# EAGLE design ScanseSweep Final (EAGLE 9.5.1)
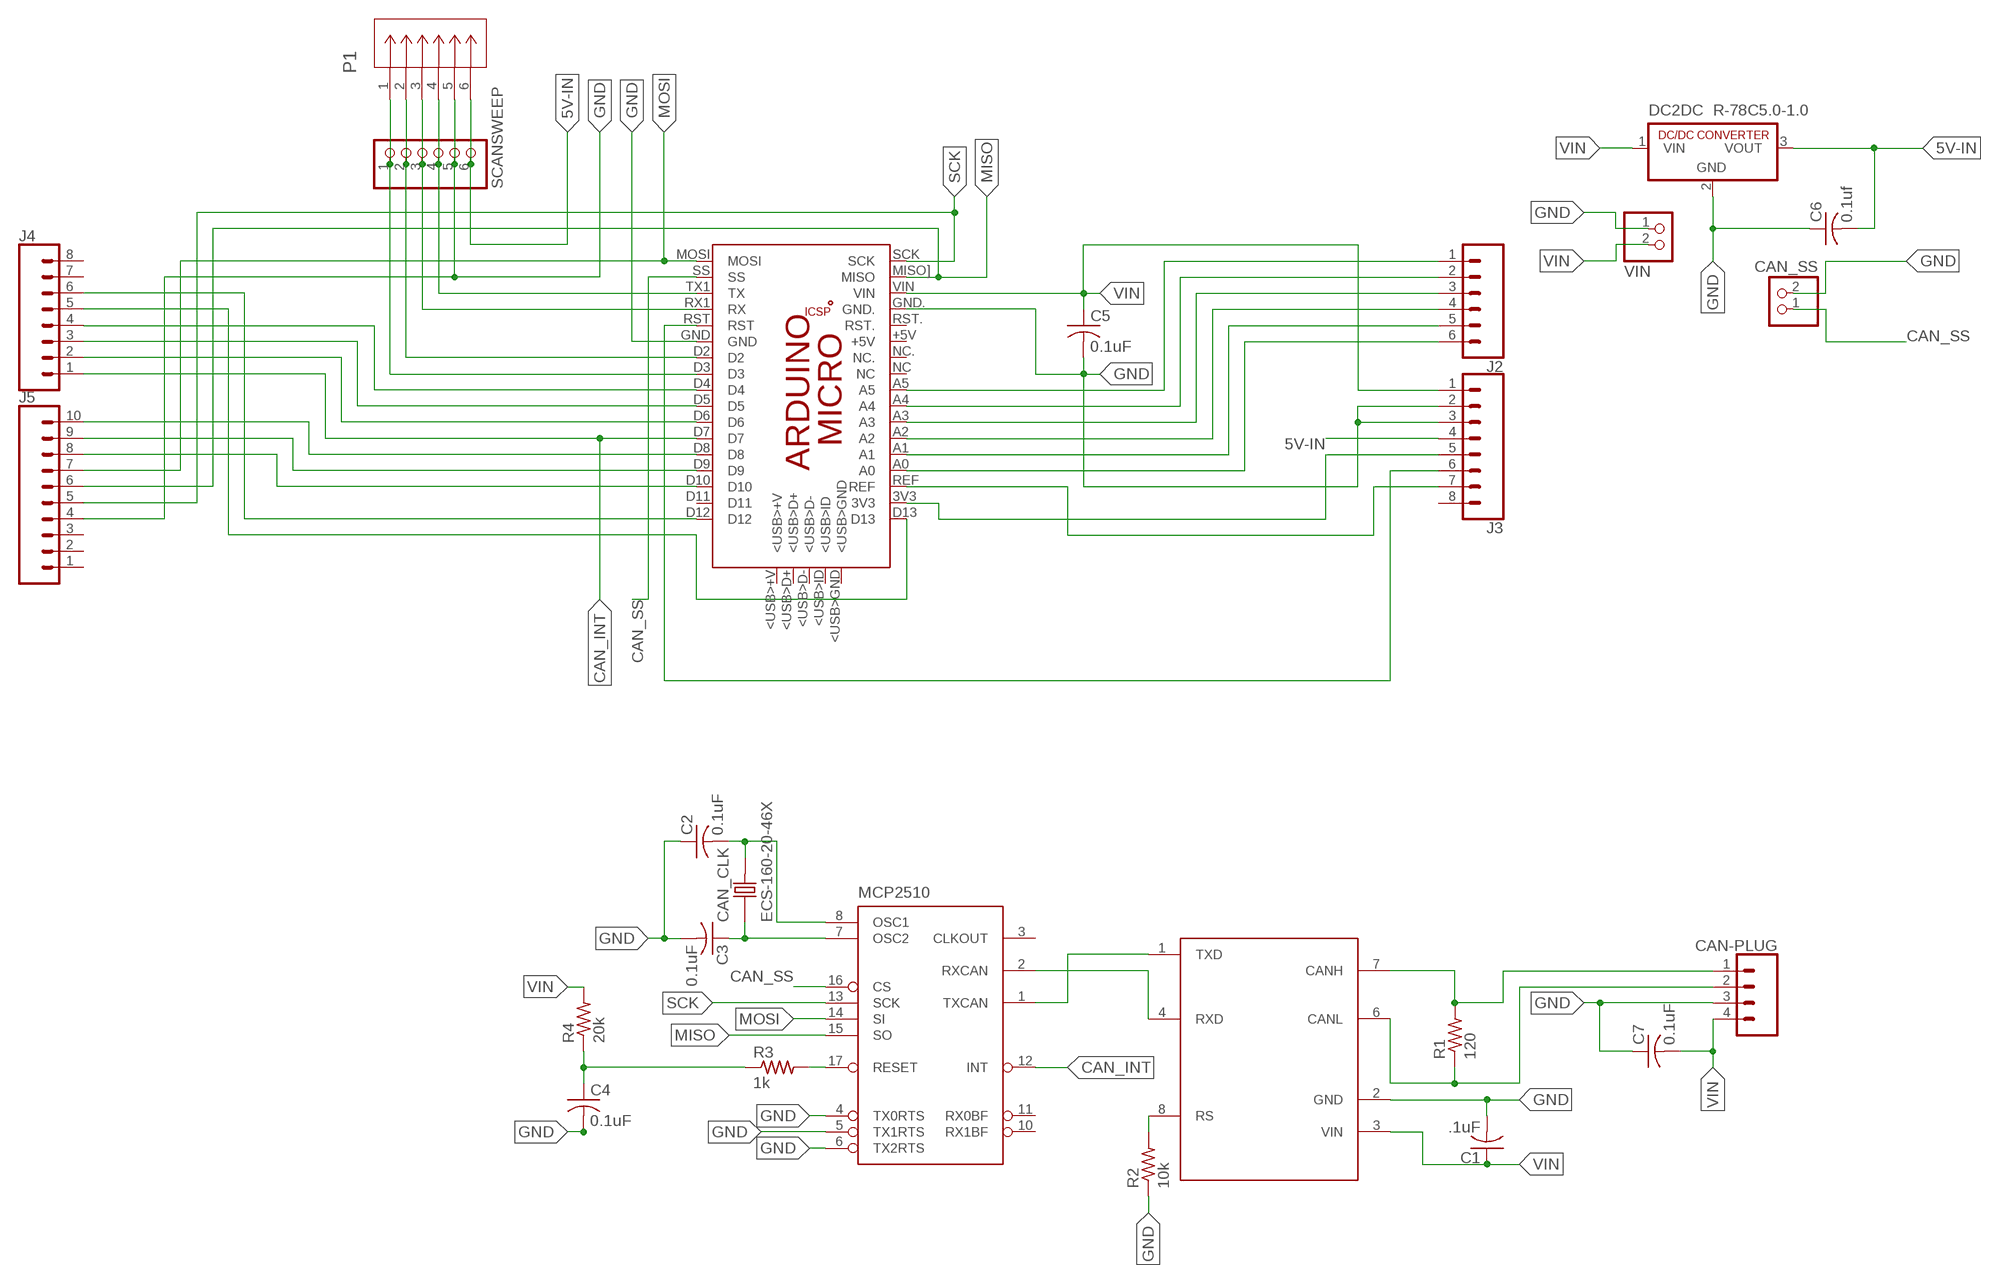
[diagram p0: schematic, sheet 1]

## Parts
C1  .1uF  C-US025-024X044  [C025-024X044]
C2  0.1uF  C-US025-024X044  [C025-024X044]
C3  0.1uF  C-US025-024X044  [C025-024X044]
C4  0.1uF  C-US025-024X044  [C025-024X044]
C5  0.1uF  C-US025-024X044  [C025-024X044]
C6  0.1uf  C-US025-024X044  [C025-024X044]
C7  0.1uF  C-US025-024X044  [C025-024X044]
CAN_CLK  ECS-160-20-46X  [XTAL_ECS-160-20-46X]
CAN_SS_TEST  CAN_SS  PINHD-1X2  [1X02]
DC2DC  R-78C5.0-1.0  [SIP3]
J1  CAN-PLUG  CONN_04SCREW  [SCREWTERMINAL-3.5MM-4]
J2  CONN_06SILK_FEMALE_PTH  [1X06]
J3  CONN_08"  [1X08]
J4  CONN_08"  [1X08]
J5  CONN_10"  [1X10]
MCP2510  MCP2510P  [DIL18]
MCP2551  MCP2551MCP2551  [DIL08]
P1  S6B-ZR(LF)(SN)  [S6B-ZR]
PCB2  ARDUINO_MICRO  [ARDUINO_MICRO]
R1  120  R-US_0204/5  [0204/5]
R2  10k  R-US_0204/5  [0204/5]
R3  1k  R-US_0204/5  [0204/5]
R4  20k  R-US_0204/5  [0204/5]
SCANSESWEEP  SCANSWEEP  PINHD-1X6  [1X06]
VIN_TEST  VIN  PINHD-1X2  [1X02]

## Nets
3.3V: J3.5 PCB2.3V3
5V-IN: C6.2 DC2DC.3(VOUT) J3.4 P1.6 SCANSESWEEP.6
A0: J2.6 PCB2.A0
A1: J2.5 PCB2.A1
A2: J2.4 PCB2.A2
A3: J2.3 PCB2.A3
A4: J2.2 PCB2.A4
A5: J2.1 PCB2.A5
CAN_INT: J4.1 MCP2510.12(INT) PCB2.D7
CAN_SS [New Class]: CAN_SS_TEST.1 MCP2510.16(CS) PCB2.SS
CANH: J1.1 MCP2551.7(CANH) R1.2
CANL: J1.2 MCP2551.6(CANL) R1.1
D2: P1.2 PCB2.D2 SCANSESWEEP.2
D3: P1.1 PCB2.D3 SCANSESWEEP.1
D4: J4.4 PCB2.D4
D5: J4.3 PCB2.D5
D6: J4.2 PCB2.D6
D8: J5.10 PCB2.D8
D9: J5.9 PCB2.D9
D10 [New Class]: J5.8 PCB2.D10
D12: J4.6 PCB2.D12
D13: J4.5 PCB2.D13
GND: C1.2 C2.1 C3.2 C4.2 C5.2 C6.1 C7.1 CAN_SS_TEST.2 DC2DC.2(GND) J1.3 J3.2 J3.3 J5.4 MCP2510.4(TX0RTS) MCP2510.5(TX1RTS) MCP2510.6(TX2RTS) MCP2551.2(GND) P1.5 PCB2.GND PCB2.GND. R2.1 SCANSESWEEP.5 VIN_TEST.1
MISO: J5.6 MCP2510.15(SO) PCB2.MISO](MISO)
MOSI: J5.7 MCP2510.14(SI) PCB2.MOSI
N$13: C4.1 R3.1 R4.1
OSC1: C2.2 CAN_CLK.2 MCP2510.8(OSC1)
OSC2: C3.1 CAN_CLK.1 MCP2510.7(OSC2)
REF: J3.7 PCB2.REF
RESET: MCP2510.17(RESET) R3.2
RS: MCP2551.8(RS) R2.2
RST: J3.6 PCB2.RST
RX: P1.3 PCB2.RX1(RX) SCANSESWEEP.3
RXCAN: MCP2510.2(RXCAN) MCP2551.4(RXD)
SCK: J5.5 MCP2510.13(SCK) PCB2.SCK
TX: P1.4 PCB2.TX1(TX) SCANSESWEEP.4
TXCAN: MCP2510.1(TXCAN) MCP2551.1(TXD)
VIN: C1.1 C5.1 C7.2 DC2DC.1(VIN) J1.4 J3.1 MCP2551.3(VIN) PCB2.VIN R4.2 VIN_TEST.2
Unconnected: J3.8 J4.7 J4.8 J5.1 J5.2 J5.3 MCP2510.3(CLKOUT) MCP2510.9(VSS) MCP2510.10(RX1BF) MCP2510.11(RX0BF) MCP2510.18(VDD) PCB2.5V PCB2.+5V PCB2.<USB>+V PCB2.<USB>D+ PCB2.<USB>D- PCB2.<USB>GND PCB2.<USB>ID PCB2.D11 PCB2.GND_ PCB2.MISO. PCB2.MOSI. PCB2.NC PCB2.NC. PCB2.RESET.. PCB2.RST. PCB2.SCK.

## Library data of the parts
C1-C7 = rcl:C-US: CAPACITOR, American symbol; SPICEPREFIX: C
CAN_CLK = ECS-160-20-46X:ECS-160-20-46X: QUARTZ CRYSTAL T/H; DESCRIPTION: Crystal 16MHz ±30ppm _Tol_ ±50ppm _Stability_ 20pF FUND 50Ohm; DIGI-KEY_PART_NUMBER: XC1759-ND; DIGI-KEY_PURCHASE_URL: https://www.digikey.com/product-detail/en/ecs-inc/ECS-160-20-46X/XC1759-ND/2676589?utm_source=snapeda&utm_medium=aggregator&utm_campaign=symbol; MF: ECS Inc.; MP: ECS-160-20-46X; PACKAGE: HC46/X ECS International
CAN_SS_TEST VIN_TEST = pinhead:PINHD-1X2: PIN HEADER
DC2DC = dc-dc-converter:R-78C*-1.0: INNOLINE DC/DC-Converter 1.0 AMP SIP3 Single Output Source: Data sheet <http://www.mikrocontroller.net/attachment/150645/157764-da-01-en-DC_DC_WANDLER_R_78C5_0_1_0.pdf>
J1 = SparkFun-Connectors:CONN_04: Multi connection point. Often used as Generic Header-pin footprint for 0.1 inch spaced/style header connections On any of the 0.1 inch spaced packages, you can populate with these: Break Away Headers - Straight <https://www.sparkfun.com/products/116> (PRT-00116) Break Away Male Headers - Right Angle <https://www.sparkfun.com/products/553> (PRT-00553) Female Headers <https://www.sparkfun.com/products/115> (PRT-00115) Break Away Headers - Machine Pin <https://www.sparkfun.com/products/117> (PRT-00117) Break Away Female Headers - Swiss Machine Pin <https://www.sparkfun.com/products/743> (PRT-00743) For SCREWTERMINALS and SPRING TERMINALS visit here: Screw Terimnals on SparkFun.com <https://www.sparkfun.com/search/results?term=Screw+Terminals> (5mm/3.5mm/2.54mm spacing) This device is also useful as a general connection point to wire up your design to another part of your project. Our various solder wires solder well into these plated through hole pads. Hook-Up Wire - Assortment (Stranded, 22 AWG) <https://www.sparkfun.com/products/11375> (PRT-11375) Hook-Up Wire - Assortment (Solid Core, 22 AWG) <https://www.sparkfun.com/products/11367> (PRT-11367) View the entire wire category on our website here <https://www.sparkfun.com/categories/141> Special notes: Molex polarized connector foot print use with SKU : PRT-08231 with associated crimp pins and housings. 1MM SMD Version SKU: PRT-10208; PROD_ID: CONN-14485
J2 = SparkFun-Connectors:CONN_06: Multi connection point. Often used as Generic Header-pin footprint for 0.1 inch spaced/style header connections On any of the 0.1 inch spaced packages, you can populate with these: Break Away Headers - Straight <https://www.sparkfun.com/products/116> (PRT-00116) Break Away Male Headers - Right Angle <https://www.sparkfun.com/products/553> (PRT-00553) Female Headers <https://www.sparkfun.com/products/115> (PRT-00115) Break Away Headers - Machine Pin <https://www.sparkfun.com/products/117> (PRT-00117) Break Away Female Headers - Swiss Machine Pin <https://www.sparkfun.com/products/743> (PRT-00743) Arduino Stackable Header - 6 Pin <https://www.sparkfun.com/products/9280> (PRT-09280) For SCREWTERMINALS and SPRING TERMINALS visit here: Screw Terimnals on SparkFun.com <https://www.sparkfun.com/search/results?term=Screw+Terminals> (5mm/3.5mm/2.54mm spacing) This device is also useful as a general connection point to wire up your design to another part of your project. Our various solder wires solder well into these plated through hole pads. Hook-Up Wire - Assortment (Stranded, 22 AWG) <https://www.sparkfun.com/products/11375> (PRT-11375) Hook-Up Wire - Assortment (Solid Core, 22 AWG) <https://www.sparkfun.com/products/11367> (PRT-11367) View the entire wire category on our website here <https://www.sparkfun.com/categories/141>; PROD_ID: CONN-08437
J3 J4 = SparkFun-Connectors:CONN_08: Multi connection point. Often used as Generic Header-pin footprint for 0.1 inch spaced/style header connections On any of the 0.1 inch spaced packages, you can populate with these: Break Away Headers - Straight <https://www.sparkfun.com/products/116> (PRT-00116) Break Away Male Headers - Right Angle <https://www.sparkfun.com/products/553> (PRT-00553) Female Headers <https://www.sparkfun.com/products/115> (PRT-00115) Break Away Headers - Machine Pin <https://www.sparkfun.com/products/117> (PRT-00117) Break Away Female Headers - Swiss Machine Pin <https://www.sparkfun.com/products/743> (PRT-00743) Arduino Stackable Header - 8 Pin <https://www.sparkfun.com/products/9279> (PRT-09279) For SCREWTERMINALS and SPRING TERMINALS visit here: Screw Terimnals on SparkFun.com <https://www.sparkfun.com/search/results?term=Screw+Terminals> (5mm/3.5mm/2.54mm spacing) This device is also useful as a general connection point to wire up your design to another part of your project. Our various solder wires solder well into these plated through hole pads. Hook-Up Wire - Assortment (Stranded, 22 AWG) <https://www.sparkfun.com/products/11375> (PRT-11375) Hook-Up Wire - Assortment (Solid Core, 22 AWG) <https://www.sparkfun.com/products/11367> (PRT-11367) View the entire wire category on our website here <https://www.sparkfun.com/categories/141> Special notes: Molex polarized connector foot print use with SKU : PRT-08231 with associated crimp pins and housings. 1MM SMD Version SKU: PRT-10208 NOTES ON THE VARIANTS LOCK and LOCK_LONGPADS... This footprint was designed to help hold the alignment of a through-hole component (i.e. 6-pin header) while soldering it into place. You may notice that each hole has been shifted either up or down by 0.005 of an inch from it's more standard position (which is a perfectly straight line). This slight alteration caused the pins (the squares in the middle) to touch the edges of the holes. Because they are alternating, it causes a "brace" to hold the component in place. 0.005 has proven to be the perfect amount of "off-center" position when using our standard breakaway headers. Although looks a little odd when you look at the bare footprint, once you have a header in there, the alteration is very hard to notice. Also,if you push a header all the way into place, it is covered up entirely on the bottom side.; PROD_ID: CONN-08438
J5 = SparkFun-Connectors:CONN_10: Multi connection point. Often used as Generic Header-pin footprint for 0.1 inch spaced/style header connections On any of the 0.1 inch spaced packages, you can populate with these: Break Away Headers - Straight <https://www.sparkfun.com/products/116> (PRT-00116) Break Away Male Headers - Right Angle <https://www.sparkfun.com/products/553> (PRT-00553) Female Headers <https://www.sparkfun.com/products/115> (PRT-00115) Break Away Headers - Machine Pin <https://www.sparkfun.com/products/117> (PRT-00117) Break Away Female Headers - Swiss Machine Pin <https://www.sparkfun.com/products/743> (PRT-00743) Arduino Stackable Header - 10 Pin <https://www.sparkfun.com/products/11376> (PRT-11376) For SCREWTERMINALS and SPRING TERMINALS visit here: Screw Terimnals on SparkFun.com <https://www.sparkfun.com/search/results?term=Screw+Terminals> (5mm/3.5mm/2.54mm spacing) This device is also useful as a general connection point to wire up your design to another part of your project. Our various solder wires solder well into these plated through hole pads. Hook-Up Wire - Assortment (Stranded, 22 AWG) <https://www.sparkfun.com/products/11375> (PRT-11375) Hook-Up Wire - Assortment (Solid Core, 22 AWG) <https://www.sparkfun.com/products/11367> (PRT-11367) View the entire wire category on our website here <https://www.sparkfun.com/categories/141> Special notes: Molex polarized connector foot print use with SKU : PRT-08231 with associated crimp pins and housings. 1MM SMD Version SKU: PRT-10208 NOTES ON THE VARIANTS LOCK and LOCK_LONGPADS... This footprint was designed to help hold the alignment of a through-hole component (i.e. 6-pin header) while soldering it into place. You may notice that each hole has been shifted either up or down by 0.005 of an inch from it's more standard position (which is a perfectly straight line). This slight alteration caused the pins (the squares in the middle) to touch the edges of the holes. Because they are alternating, it causes a "brace" to hold the component in place. 0.005 has proven to be the perfect amount of "off-center" position when using our standard breakaway headers. Although looks a little odd when you look at the bare footprint, once you have a header in there, the alteration is very hard to notice. Also,if you push a header all the way into place, it is covered up entirely on the bottom side.; PROD_ID: CONN-11563
MCP2510 = microchip_can:MCP2510
MCP2551 = MCP2551:MCP2551
P1 = 6POS:S6B-ZR(LF)(SN); MANUFACTURER_PART_NUMBER: S6BZRLFSN; VENDOR: JST
PCB2 = E14_Arduino_revC:ARDUINO_MICRO: Device for representing an Arduino Micro board with a footprint in an EAGLE design. Created by Dave Young for Element14. More EAGLE documentation at: http://www.element14.com/community/community/knode/cadsoft_eagle
R1-R4 = rcl:R-US_: RESISTOR, American symbol; SPICEPREFIX: R
SCANSESWEEP = pinhead:PINHD-1X6: PIN HEADER

## Net classes
0 default: width 0.011 mm

## Board
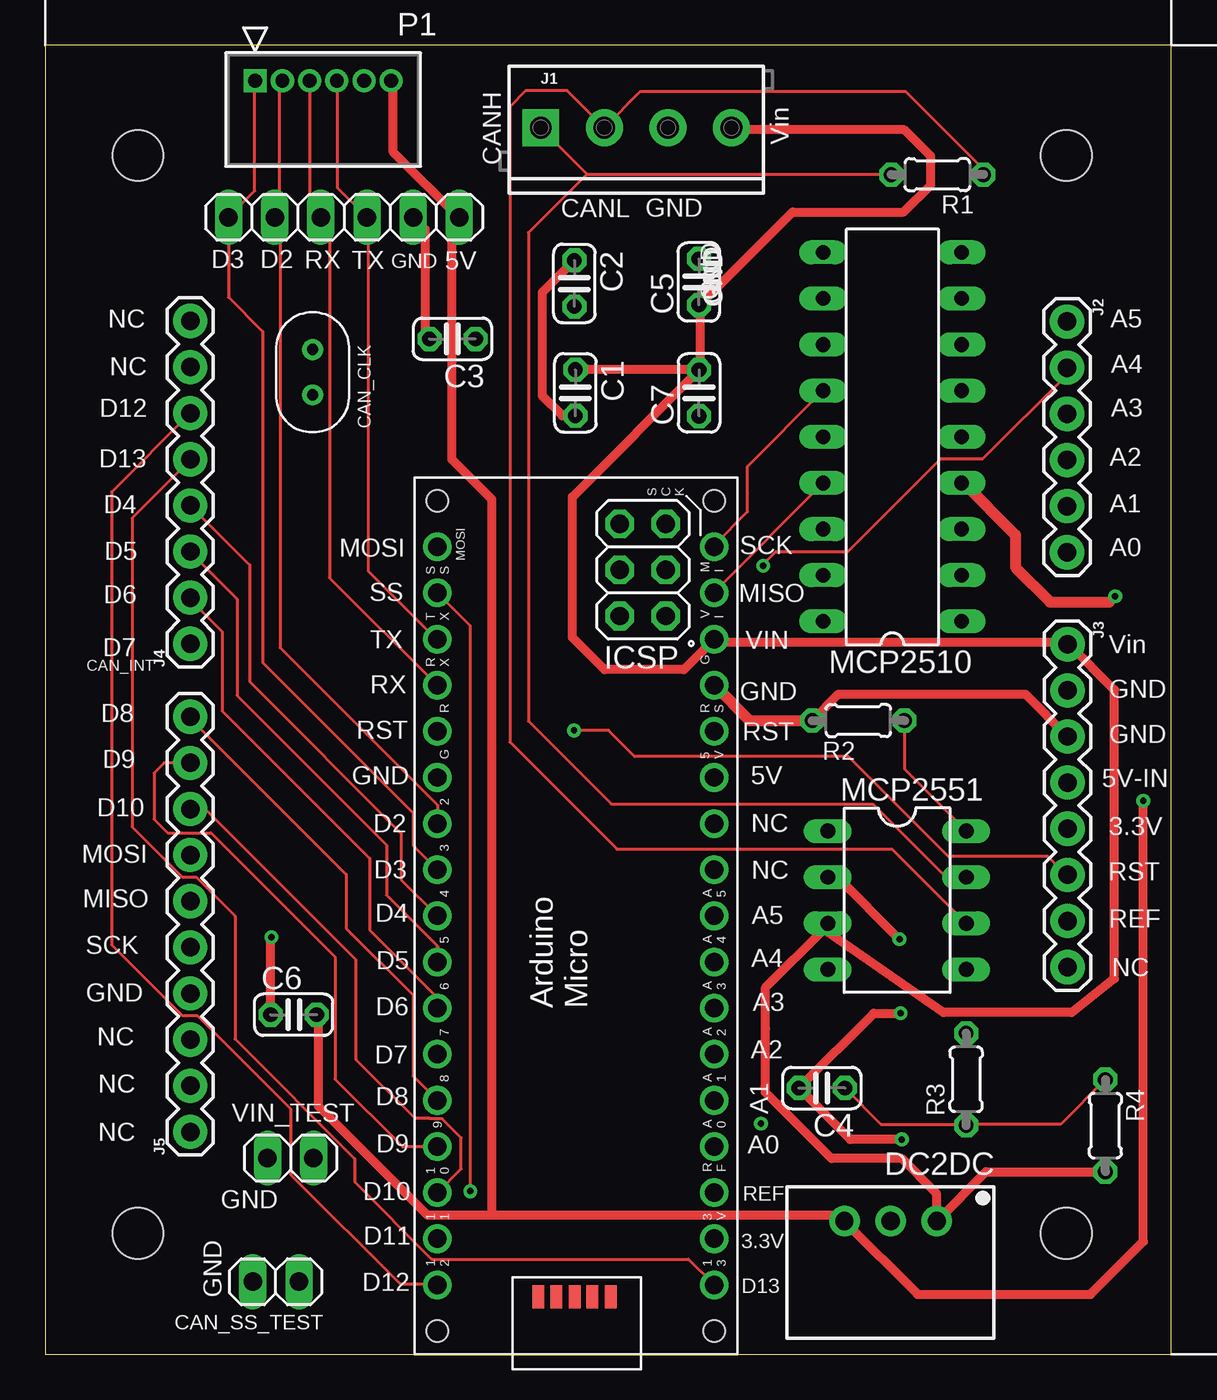
[diagram p1: board, top side]
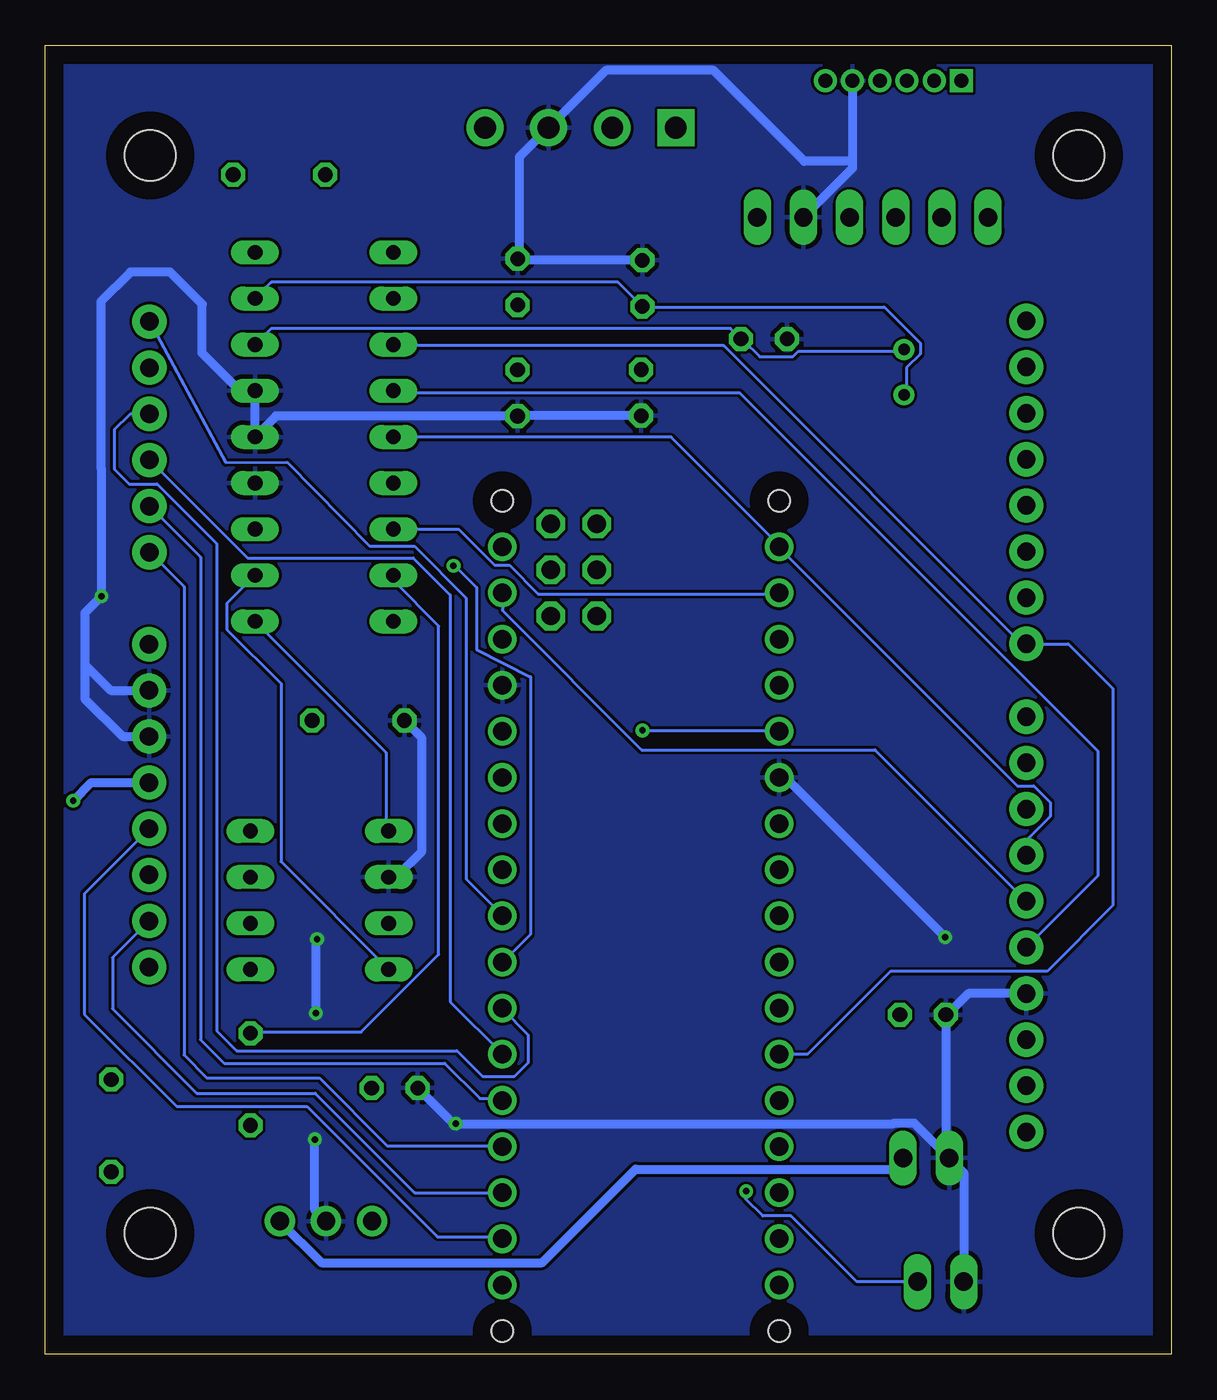
[diagram p2: board, bottom side, seen from below]

Size 61.99 x 72.06 mm. Coordinates in mm from the lower left corner, seen from the top.
Outline: 0,0 61.99,0 61.99,72.06 0,72.06 0,0
Copper layers (1*16): Top 0.035mm / dielectric 1.5mm / Bottom 0.035mm
Design rules "default": minimum track width 6mil, minimum drill 0.35mm, track to track 6mil, track to pad 6mil, pad to pad 6mil, via to via 6mil, smd to smd 6mil, copper to edge 40mil, drill to drill 6mil, minimum pad ring 10mil, minimum via ring 8mil, stop-mask expansion 4mil, vias tented up to drill 0mil, thermal gap 10mil
Holes 2.8 mm at 5.09,66 56.22,66 5.09,6.65 56.22,6.65

### Footprints (pad centres in the part's own frame; a part is rotated, then mirrored left to right if it is on the bottom)
C025-024X044 = drill 0.813 octagon: 1 -1.27,0; 2 1.27,0
XTAL_ECS-160-20-46X = drill 0.63 pad 1.03: 1 -1.25,0; 2 1.25,0
1X02 = drill 1.016 long: 1 -1.27,0; 2 1.27,0
SIP3 = drill 1 pad 1.676: 1 -2.54,0; 2 0,0; 3 2.54,0
SCREWTERMINAL-3.5MM-4 = drill 1.2 pad 2.032 square: 1 0,0 | drill 1.2 pad 2.032: 2 3.5,0; 3 7,0; 4 10.5,0
1X06 = drill 1.016 pad 1.88: 1 0,0; 2 2.54,0; 3 5.08,0; 4 7.62,0; 5 10.16,0; 6 12.7,0
1X08 = drill 1.016 pad 1.88: 1 0,0; 2 2.54,0; 3 5.08,0; 4 7.62,0; 5 10.16,0; 6 12.7,0; 7 15.24,0; 8 17.78,0
1X10 = drill 1.016 pad 1.88: 1 0,0; 2 2.54,0; 3 5.08,0; 4 7.62,0; 5 10.16,0; 6 12.7,0; 7 15.24,0; 8 17.78,0; 9 20.32,0; 10 22.86,0
DIL18 = drill 0.813 long: 1 -10.16,-3.81; 2 -7.62,-3.81; 3 -5.08,-3.81; 4 -2.54,-3.81; 5 0,-3.81; 6 2.54,-3.81; 7 5.08,-3.81; 8 7.62,-3.81; 9 10.16,-3.81; 10 10.16,3.81; 11 7.62,3.81; 12 5.08,3.81; 13 2.54,3.81; 14 0,3.81; 15 -2.54,3.81; 16 -5.08,3.81; 17 -7.62,3.81; 18 -10.16,3.81
DIL08 = drill 0.813 long: 1 -3.81,-3.81; 2 -1.27,-3.81; 3 1.27,-3.81; 4 3.81,-3.81; 5 3.81,3.81; 6 1.27,3.81; 7 -1.27,3.81; 8 -3.81,3.81
S6B-ZR = drill 0.762 pad 1.27 square: 1 -7.493,0 | drill 0.762 pad 1.27: 2 -5.994,0; 3 -4.496,0; 4 -2.997,0; 5 -1.499,0; 6 0,0
ARDUINO_MICRO = drill 1.016 pad 1.575: 3V3 6.35,1.27; +5V 31.75,1.27; A0 11.43,1.27; A1 13.97,1.27; A2 16.51,1.27; A3 19.05,1.27; A4 21.59,1.27; A5 24.13,1.27; D2 29.21,16.51; D3 26.67,16.51; D4 24.13,16.51; D5 21.59,16.51; D6 19.05,16.51; D7 16.51,16.51; D8 13.97,16.51; D9 11.43,16.51; D10 8.89,16.51; D11 6.35,16.51; D12 3.81,16.51; D13 3.81,1.27; GND 31.75,16.51; GND. 36.83,1.27; MISO] 41.91,1.27; MOSI 44.45,16.51; NC 26.67,1.27; NC. 29.21,1.27; REF 8.89,1.27; RST 34.29,16.51; RST. 34.29,1.27; RX1 36.83,16.51; SCK 44.45,1.27; SS 41.91,16.51; TX1 39.37,16.51; VIN 39.37,1.27 | drill 1.016 pad 1.575 octagon: 5V 40.64,6.477; GND_ 45.72,6.477; MISO. 40.64,3.937; MOSI. 43.18,6.477; RESET.. 45.72,3.937; SCK. 43.18,3.937 | smd 1.27 x 0.635: <USB>+V 3.15,10.947; <USB>D+ 3.15,9.957; <USB>D- 3.15,8.941; <USB>GND 3.15,6.96; <USB>ID 3.15,7.976 | hole 1.2: 1.27,1.27; 1.27,16.51; 46.99,16.51; 46.99,1.27
0204/5 = drill 0.813 octagon: 1 -2.54,0; 2 2.54,0
1X06' = drill 1.016 long: 1 -6.35,0; 2 -3.81,0; 3 -1.27,0; 4 1.27,0; 5 3.81,0; 6 6.35,0

### Placement (x,y rotation side)
C1  29.18,52.93 270 top
C2  29.12,58.95 270 top
C3  22.41,55.9 180 top
C4  42.76,14.65 180 top
C5  35.98,59.04 90 top
C6  13.67,18.69 0 top
C7  35.99,52.92 90 top
CAN_CLK  14.72,54.06 270 top
CAN_SS_TEST  12.69,3.98 180 top
DC2DC  46.54,7.32 180 top
J1  27.28,67.53 0 top
J2  56.26,56.85 270 top
J3  56.28,39.09 270 top
J4  7.97,39.11 90 top
J5  7.97,12.24 90 top
MCP2510  46.64,50.51 90 top
MCP2551  46.9,24.99 270 top
P1  19.04,70.12 0 top
PCB2  38.1,0 90 top
R1  49.11,64.94 180 top
R2  44.76,34.88 0 top
R3  50.7,15.13 90 top
R4  58.37,12.58 270 top
SCANSESWEEP  SCANSWEEP  [1X06']  16.44,62.6 0 top
VIN_TEST  13.5,10.79 0 top

### Tracks (layer width: path | path; a pad name or v marks a point on that pad's centre or on a via)
3.3V
  Bottom 0.152: J3.5 56.28,28.91 59.85,25.35 59.85,18.72 54.76,13.63 47.59,13.63 40.41,6.45 36.93,6.45 PCB2.3V3
5V-IN  (via drill 0.35)
  Top 0.152: 19.15,70 P1.6 | 22.75,62.6 SCANSESWEEP.6 | 15.04,18.64 C6.2 | 43.94,7.65 DC2DC.3
  Top 0.508: 19.15,70 19.15,66.19 22.75,62.6 | 15.04,18.64 15.04,13.65 21.04,7.65 24.59,7.65 | 43.94,7.65 24.59,7.65 | 24.59,7.65 24.59,47.06 22.37,49.27 22.37,62.18 SCANSESWEEP.6 | DC2DC.3 48.03,3.29 57.54,3.29 60.46,6.21 v60.46,30.47
  Bottom 0.508: v60.46,30.47 59.46,31.47 J3.4
A0
  Bottom 0.152: PCB2.A0 36.88,11.48 43.18,11.48 46.9,15.21 53.1,15.21 54.36,16.47 54.36,42.25 J2.6
A1
  Bottom 0.152: PCB2.A1 36.93,14.07 38.06,14.07 40,16.01 52.15,16.01 53.44,17.3 53.44,43.88 J2.5
A2
  Bottom 0.152: PCB2.A2 39.7,19.39 39.7,41.81 41.73,43.84 50.87,43.84 J2.4
A3
  Bottom 0.152: PCB2.A3 36.83,19 35.39,17.56 35.39,16.06 36.17,15.28 37.91,15.28 39.33,16.71 51.45,16.71 52.55,17.8 52.55,44.63 55.84,47.92 57.38,47.92 58.2,48.73 58.2,50.89 57.32,51.77 J2.3
A4  (via drill 0.35)
  Top 0.152: J2.2 56.26,53.94 51.6,49.28 49.27,49.28 44.16,44.17 40.2,44.17 39.48,43.45 v39.52,43.4
  Bottom 0.152: PCB2.A4 36.8,21.59 35.27,23.12 35.27,37.29 38.24,38.79 38.24,42.21 39.48,43.45 v39.52,43.4
A5
  Bottom 0.152: PCB2.A5 36.83,24.16 38.82,26.15 38.82,41.63 41.67,44.48 44.13,44.48 48.68,49.11 52.06,49.09 J2.1
CAN_INT
  Bottom 0.152: MCP2510.12 42.77,55.52 24.64,55.52 8.33,39.22 8.03,39.22 J4.1 5.67,39.11 3.22,36.66 3.22,24.69 6.83,21.08 15.45,21.08 20.02,16.51 PCB2.D7
CAN_SS  (via drill 0.35)
  Top 0.152: v23.4,8.97 23.4,40.1 PCB2.SS
  Bottom 0.152: MCP2510.16 39.24,45.43 37.25,43.43 36.44,43.43 34.86,41.85 21.65,41.85 PCB2.SS | CAN_SS_TEST.1 17.32,3.98 20.94,7.61 22.48,7.61 23.4,8.53 v23.4,8.97
CANH
  Top 0.152: 29.82,64.97 27.38,67.41 J1.1 | MCP2551.7 49.59,26.26 45.57,30.29 31.16,30.29 26.6,34.85 26.6,61.75 29.82,64.97 | 29.82,64.97 46.54,64.97 R1.2
CANL
  Top 0.152: MCP2551.6 46.62,27.81 31.47,27.81 25.58,33.7 25.58,68.7 26.45,69.57 28.73,69.57 J1.2 32.78,69.53 47.36,69.53 51.66,65.24 R1.1
D2
  Top 0.152: P1.2 12.9,70 12.9,62.84 12.75,62.69 SCANSESWEEP.2 12.92,62.31 12.92,38.9 21.59,30.23 PCB2.D2
D3
  Top 0.152: P1.1 11.53,70 11.53,64.06 10.16,62.69 SCANSESWEEP.1 10.09,58.19 11.98,56.31 11.98,38.08 20.26,29.8 20.26,28.01 PCB2.D3
D4
  Top 0.152: PCB2.D4 19.6,26.12 19.6,28.67 11.25,37.02 11.25,43.46 J4.4
D5
  Top 0.152: PCB2.D5 21.59,22.47 18.78,25.28 18.78,28.04 10.55,36.27 10.55,41.57 8.03,44.09 J4.3
D6
  Top 0.152: PCB2.D6 21.59,19.61 17.86,23.35 17.86,27.3 9.73,35.42 9.73,39.8 7.97,41.56 J4.2
D8
  Top 0.152: PCB2.D8 20.24,15.32 20.24,19.77 16.56,23.45 16.56,26.42 7.98,35 J5.10
D9
  Top 0.152: J5.9 6.54,32.55 5.98,32 5.98,29.45 6.73,28.7 9.12,28.7 15.95,21.88 15.95,15.14 19.69,11.4 21.56,11.4 PCB2.D9
D10
  Top 0.152: PCB2.D10 22.89,10.19 22.89,11.91 21.85,12.95 21.17,12.95 21.15,12.97 20.35,12.97 17.12,16.21 17.12,21.7 8.8,30.02 J5.8
D12
  Top 0.152: PCB2.D12 21.54,3.86 19.54,3.86 13.52,9.88 13.52,13.49 8.36,18.64 7.53,18.64 3.64,22.54 3.64,47.47 J4.6
D13
  Top 0.152: J4.5 7.97,49.22 4.77,46.02 4.77,29.03 7.53,26.26 8.3,26.26 10.44,24.12 10.44,17.35 17.03,10.76 17.03,9.48 21.27,5.23 35.41,5.23 PCB2.D13
GND  (via drill 0.35)
  Top 0.152: MCP2510.4 50.57,47.97 | 58.89,41.72 v58.91,41.72
  Top 0.406: 58.89,41.72 58.57,41.4
  Top 0.508: SCANSESWEEP.5 20.92,61.93 20.92,56.13 C3.2 | C2.1 27.35,58.45 27.35,52.78 28.47,51.66 C1.2 | R2.1 43.68,36.34 53.95,36.34 J3.3 | v47.09,18.77 45.61,18.77 C4.2 44.31,11.82 v47.16,11.82 | v47.03,22.84 43.61,26.26 MCP2551.2 | C6.1 12.4,22.91 v12.44,22.95
  Top 0.61: PCB2.GND. 38.78,34.88 R2.1 | 50.57,47.97 53.42,45.11 53.42,43.31 55.33,41.4 58.57,41.4
  Bottom 0.508: 17.55,65.7 17.53,65.68 | 17.53,65.68 17.53,65.31 SCANSESWEEP.5 | 17.53,65.68 20.2,65.68 25.2,70.68 31.12,70.68 J1.3 35.9,65.9 35.9,60.23 | C2.1 35.9,60.23 | 35.9,60.23 C5.2 | C1.2 35.98,51.66 C7.1 49.3,51.66 MCP2510.5 MCP2510.6 51.29,53.05 53.36,55.12 53.36,57.8 53.35,57.81 55.12,59.59 57.3,59.59 58.94,57.94 58.94,48.79 58.91,48.76 v58.91,41.72 59.81,40.82 59.81,37.97 | R2.1 41.29,33.94 41.29,27.65 42.67,26.26 MCP2551.2 | 59.81,37.97 58.39,36.55 J3.2 | 59.81,37.97 59.81,36.08 57.74,34.01 J3.3 | C6.1 12.4,18.62 | 12.4,18.62 12.4,10.97 | 12.4,10.97 VIN_TEST.1 11.42,9.99 CAN_SS_TEST.2 | J5.4 11.16,19.86 12.4,18.62 | v47.09,18.77 47.09,22.78 v47.03,22.84 | DC2DC.2 47.16,7.94 v47.16,11.82 | C4.2 39.53,12.69 v39.4,12.69 15.29,12.69 15.25,12.73 14.16,12.73 12.4,10.97 | PCB2.GND 21.24,31.75 v12.44,22.95 | 17.53,65.68 17.53,70.11 P1.5
  pour Bottom: -1.37,73.46 64.63,73.46 64.63,-2.54 -1.37,-2.54
MISO
  Top 0.152: PCB2.MISO] 36.83,41.96 42.83,47.96 MCP2510.15
  Bottom 0.152: PCB2.MISO] 36.83,40.95 29.15,33.27 16.31,33.27 J5.6
MOSI
  Bottom 0.152: MCP2510.14 42.77,50.49 27.53,50.49 21.59,44.55 PCB2.MOSI 21.59,44.4 8.48,31.29 7.57,31.29 6.66,30.38 6.66,29.62 7.87,28.4 7.87,27.48 J5.7
N$13
  Top 0.152: R4.1 55.91,12.66 50.7,12.66 R3.1 50.7,12.64 50.69,12.66 46.02,12.66 C4.1
OSC1
  Bottom 0.152: CAN_CLK.2 14.58,52.93 14.58,54.3 13.82,55.07 13.82,55.68 15.8,57.66 29.06,57.66 C2.2 30.45,59.01 49.56,59.01 MCP2510.8
OSC2
  Bottom 0.152: CAN_CLK.1 14.73,55.22 20.52,55.22 20.83,54.91 22.66,54.91 23.57,55.83 C3.1 24.26,56.47 49.56,56.47 MCP2510.7
REF
  Bottom 0.152: PCB2.REF 41.65,8.89 47.13,14.37 53.65,14.37 58.3,19.02 58.3,21.84 J3.7
RESET
  Bottom 0.152: MCP2510.17 42.77,42.88 42.77,42.53 40.33,40.09 40.33,22 44.6,17.73 50.7,17.73 R3.2
RS
  Top 0.152: R2.2 47.3,32.21 MCP2551.8
RST  (via drill 0.35)
  Top 0.152: v29.11,34.34 31.01,34.34 32.45,32.91 44.21,32.91 49.73,27.39 55.21,27.39 56.21,26.39 J3.6
  Bottom 0.152: v29.11,34.34 21.59,34.34 PCB2.RST
RX
  Top 0.152: P1.3 14.58,70 14.58,63.14 15.04,62.69 SCANSESWEEP.3 15.19,62.54 15.65,62.08 15.65,42.74 21.56,36.83 PCB2.RX1
RXCAN
  Bottom 0.152: MCP2510.2 52,41.34 52,39.91 49.02,36.93 49.02,27.12 MCP2551.4
SCK
  Top 0.152: PCB2.SCK 36.83,44.55 38.66,46.38 38.66,47.39 38.66,48.88 MCP2510.13
  Bottom 0.152: MCP2510.13 42.72,52.93 23.77,52.93 4.03,33.2 4.03,26.34 J5.5
TX
  Top 0.152: P1.4 16.1,70 16.1,64.21 17.63,62.69 SCANSESWEEP.4 17.78,62.54 17.78,43.12 21.53,39.37 PCB2.TX1
TXCAN
  Bottom 0.152: MCP2551.1 43.23,28.85 43.23,33.12 50.39,40.28 MCP2510.1
VIN
  Top 0.152: 36.07,57.66 C5.1 36.02,57.77 | 36.07,54.22 36.03,54.21 C7.2 35.99,54.2 | PCB2.VIN 36.98,39.22 | 56.19,39.22 J3.1 56.34,39.09 | 37.89,67.41 J1.4
  Top 0.508: 36.07,54.22 36.07,57.66 | 36.98,39.22 56.19,39.22 | 56.34,39.09 58.86,36.57 58.86,20.67 56.51,18.8 49.45,18.8 43.04,23.28 | 43.04,23.28 42.87,23.39 39.66,20.18 39.66,17.91 39.65,14.41 43.29,10.77 47.15,10.77 49.02,8.87 49.08,8.81 DC2DC.1 51.8,10.04 R4.2 | 35.99,54.2 C1.1 | 36.02,57.77 41.14,62.88 47.25,62.88 48.75,64.37 48.75,65.96 47.3,67.41 37.89,67.41 | PCB2.VIN 35.16,37.7 30.8,37.7 29.02,39.47 29.02,47.2 36.03,54.21 | MCP2551.3 43.09,23.32 43.04,23.28
  Bottom 0.508: VIN_TEST.2 15.38,10.19 29.49,10.19 34.64,5.03 46.79,5.03 DC2DC.1

### Text on the board
tNames: Vin | CANH | CANL | GND | GND | GND | GND | GND | D3 | D2 | RX | TX | GND | 5V | NC | A5 | A4 | NC | D12 | A3 | D13 | A2 | D4 | A1 | SCK | D5 | MOSI | A0 | D6 | SS | MISO | D7 | TX | VIN | Vin | CAN_INT | RX | GND | GND | D8 | RST | RST | GND | D9 | GND | 5V | 5V-IN | D10 | D2 | NC | 3.3V | MOSI | D3 | NC | RST | MISO | D4 | A5 | REF | SCK | D5 | A4 | NC | GND | D6 | A3 | NC | D7 | A2 | NC | D8 | A1 | NC | D9 | A0 | GND | D10 | REF | D11 | 3.3V | GND | D12 | D13